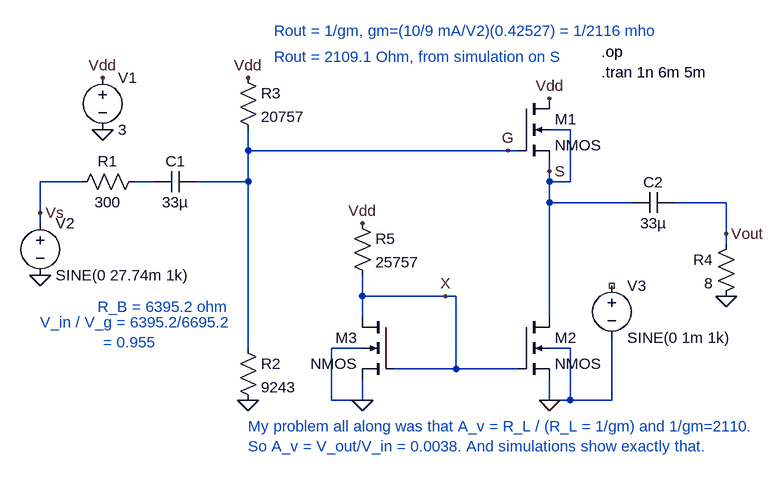
[diagram p0: schematic CD-amp-current-gain.asc]
CD-amp-current-gain.asc, the LTspice schematic file:
Version 4
SHEET 1 1228 700
WIRE 240 208 208 208
WIRE -256 240 -256 208
WIRE 144 240 -256 240
WIRE 160 240 144 240
WIRE 208 272 208 256
WIRE -512 288 -576 288
WIRE -400 288 -432 288
WIRE -256 288 -256 240
WIRE -256 288 -336 288
WIRE 208 288 208 272
WIRE 240 288 240 208
WIRE 240 288 208 288
WIRE 208 320 208 288
WIRE 336 320 208 320
WIRE 480 320 400 320
WIRE -576 336 -576 288
WIRE -576 352 -576 336
WIRE 480 368 480 320
WIRE 480 384 480 368
WIRE -80 464 -80 432
WIRE 48 464 -80 464
WIRE 64 464 48 464
WIRE -80 496 -80 464
WIRE 208 496 208 320
WIRE -256 544 -256 288
WIRE -80 544 -128 544
WIRE 240 544 208 544
WIRE 64 576 64 464
WIRE 64 576 -32 576
WIRE 160 576 64 576
WIRE -128 624 -128 544
WIRE -80 624 -80 592
WIRE -80 624 -128 624
WIRE 208 624 208 592
WIRE 240 624 240 544
WIRE 240 624 208 624
WIRE 304 624 304 528
WIRE 304 624 240 624
FLAG -480 128 Vdd
FLAG -256 128 Vdd
FLAG 208 160 Vdd
FLAG -480 208 0
FLAG -256 624 0
FLAG 144 240 G
FLAG 208 272 S
FLAG -576 432 0
FLAG 480 464 0
FLAG -80 352 Vdd
FLAG -80 624 0
FLAG 208 624 0
FLAG -576 336 Vs
FLAG 480 368 Vout
FLAG 48 464 X
DATAFLAG -160 240 "$"
DATAFLAG 208 400 "$"
DATAFLAG 64 576 "$"
SYMBOL Res -272 528 R0
SYMATTR InstName R2
SYMATTR Value 9243
SYMBOL Res -272 112 R0
SYMATTR InstName R3
SYMATTR Value 20757
SYMBOL voltage -480 112 R0
SYMATTR InstName V1
SYMATTR Value 3
SYMBOL nmos4 160 160 R0
SYMATTR InstName M1
SYMATTR Value2 l=0.18 w=10
SYMBOL voltage -576 336 R0
SYMATTR InstName V2
SYMATTR Value SINE(0 27.74m 1k)
SYMBOL Cap -400 272 M90
WINDOW 0 0 32 VBottom 2
WINDOW 3 32 32 VTop 2
SYMATTR InstName C1
SYMATTR Value 33µ
SYMBOL Cap 336 304 M90
WINDOW 0 0 32 VBottom 2
WINDOW 3 32 32 VTop 2
SYMATTR InstName C2
SYMATTR Value 33µ
SYMBOL Res 496 368 M0
SYMATTR InstName R4
SYMATTR Value 8
SYMBOL nmos4 160 496 R0
SYMATTR InstName M2
SYMATTR Value2 l=0.18 w=10
SYMBOL nmos4 -32 496 M0
SYMATTR InstName M3
SYMATTR Value2 l=0.18 w=10
SYMBOL Res -96 336 R0
SYMATTR InstName R5
SYMATTR Value 25757
SYMBOL Res -528 304 R270
WINDOW 0 32 56 VTop 2
WINDOW 3 0 56 VBottom 2
SYMATTR InstName R1
SYMATTR Value 300
SYMBOL voltage 304 432 R0
SYMATTR InstName V3
SYMATTR Value SINE(0 1m 1k)
TEXT 288 88 Left 2 !.op\n.tran 1n 6m 5m
TEXT -216 96 Left 2 ;Rout = 2109.1 Ohm, from simulation on S
TEXT -216 56 Left 2 ;Rout = 1/gm, gm=(10/9 mA/V2)(0.42527) = 1/2116 mho
TEXT -256 664 Left 2 ;My problem all along was that A_v = R_L / (R_L = 1/gm) and 1/gm=2110. \nSo A_v = V_out/V_in = 0.0038. And simulations show exactly that.
TEXT -488 480 Left 2 ;R_B = 6395.2 ohm
TEXT -576 504 Left 2 ;V_in / V_g = 6395.2/6695.2 \n              = 0.955

The netlist it stands for:
* CD-amp-current-gain.asc
R2 G 0 9243
R3 Vdd G 20757
V1 Vdd 0 3
M1 Vdd G S S NMOS l=0.18 w=10
V2 Vs 0 SINE(0 27.74m 1k)
C1 N001 G 33µ
C2 S Vout 33µ
R4 Vout 0 8
M2 S X 0 0 NMOS l=0.18 w=10
M3 X X 0 0 NMOS l=0.18 w=10
R5 Vdd X 25757
R1 Vs N001 300
V3 NC_01 0 SINE(0 1m 1k)
.model NMOS NMOS
.model PMOS PMOS
.lib standard.mos
.op
.tran 1n 6m 5m
* Rout = 2109.1 Ohm, from simulation on S
* Rout = 1/gm, gm=(10/9 mA/V2)(0.42527) = 1/2116 mho
* My problem all along was that A_v = R_L / (R_L = 1/gm) and 1/gm=2110.
* So A_v = V_out/V_in = 0.0038. And simulations show exactly that.
* R_B = 6395.2 ohm
* V_in / V_g = 6395.2/6695.2
*               = 0.955
.backanno
.end